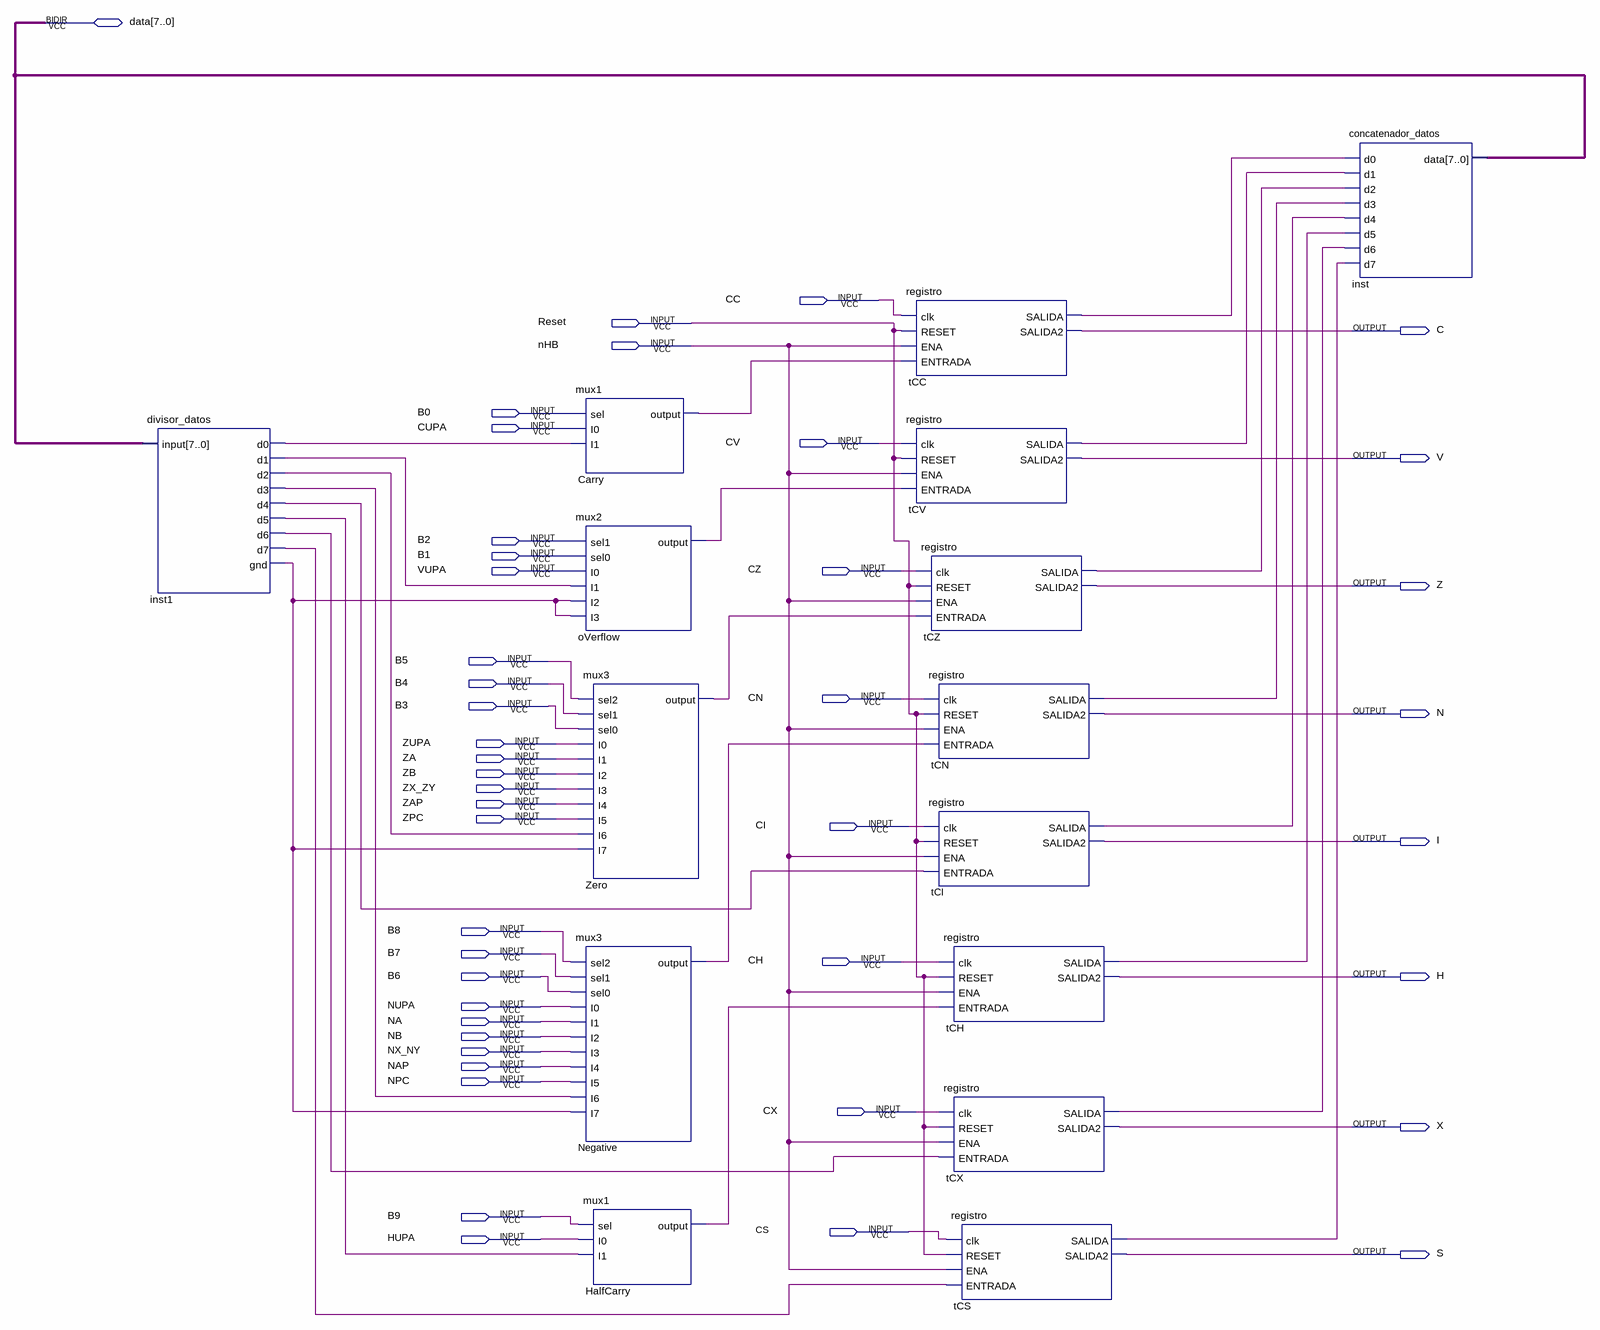
[diagram p0: schematic sheet]
// Quartus schematic RegEdos.bdf as structural Verilog: 15 symbols, 44 pins
module RegEdos (
  input  CC,
  input  Reset,
  input  nHB,
  input  B0,
  input  CUPA,
  input  CV,
  input  B2,
  input  B1,
  input  VUPA,
  input  CZ,
  input  B5,
  input  B4,
  input  CN,
  input  B3,
  input  ZUPA,
  input  ZA,
  input  ZB,
  input  ZX_ZY,
  input  ZAP,
  input  ZPC,
  input  CI,
  input  B8,
  input  B7,
  input  CH,
  input  B6,
  input  NUPA,
  input  NA,
  input  NB,
  input  NX_NY,
  input  NAP,
  input  NPC,
  input  CX,
  input  B9,
  input  CS,
  input  HUPA,
  inout  [7:0] data,
  output C,
  output V,
  output Z,
  output N,
  output I,
  output H,
  output X,
  output S
);

  wire Carry_output, HalfCarry_output, inst1_d0, inst1_d1, inst1_d2, inst1_d3, inst1_d4, inst1_d5, inst1_d6,
       inst1_d7, inst1_gnd, Negative_output, oVerflow_output, tCC_salida, tCH_salida, tCI_salida, tCN_salida,
       tCS_salida, tCV_salida, tCX_salida, tCZ_salida, Zero_output;

  divisor_datos inst1 (
    .\input (data), .d0(inst1_d0), .d1(inst1_d1), .d2(inst1_d2), .d3(inst1_d3), .d4(inst1_d4), .d5(inst1_d5),
    .d6(inst1_d6), .d7(inst1_d7), .gnd(inst1_gnd));
  mux1 Carry (.sel(B0), .I0(CUPA), .I1(inst1_d0), .\output (Carry_output));
  mux2 oVerflow (
    .sel1(B2), .sel0(B1), .I0(VUPA), .I1(inst1_d1), .I2(inst1_gnd), .I3(inst1_gnd), .\output (oVerflow_output));
  mux3 Zero (
    .sel2(B5), .sel1(B4), .sel0(B3), .I0(ZUPA), .I1(ZA), .I2(ZB), .I3(ZX_ZY), .I4(ZAP), .I5(ZPC),
    .I6(inst1_d2), .I7(inst1_gnd), .\output (Zero_output));
  mux3 Negative (
    .sel2(B8), .sel1(B7), .sel0(B6), .I0(NUPA), .I1(NA), .I2(NB), .I3(NX_NY), .I4(NAP), .I5(NPC),
    .I6(inst1_d3), .I7(inst1_gnd), .\output (Negative_output));
  mux1 HalfCarry (.sel(B9), .I0(HUPA), .I1(inst1_d5), .\output (HalfCarry_output));
  registro tCC (.clk(CC), .RESET(Reset), .ENA(nHB), .ENTRADA(Carry_output), .SALIDA(tCC_salida), .SALIDA2(C));
  registro tCV (.clk(CV), .RESET(Reset), .ENA(nHB), .ENTRADA(oVerflow_output), .SALIDA(tCV_salida), .SALIDA2(V));
  registro tCZ (.clk(CZ), .RESET(Reset), .ENA(nHB), .ENTRADA(Zero_output), .SALIDA(tCZ_salida), .SALIDA2(Z));
  registro tCN (.clk(CN), .RESET(Reset), .ENA(nHB), .ENTRADA(Negative_output), .SALIDA(tCN_salida), .SALIDA2(N));
  registro tCI (.clk(CI), .RESET(Reset), .ENA(nHB), .ENTRADA(inst1_d4), .SALIDA(tCI_salida), .SALIDA2(I));
  registro tCH (.clk(CH), .RESET(Reset), .ENA(nHB), .ENTRADA(HalfCarry_output), .SALIDA(tCH_salida), .SALIDA2(H));
  registro tCX (.clk(CX), .RESET(Reset), .ENA(nHB), .ENTRADA(inst1_d6), .SALIDA(tCX_salida), .SALIDA2(X));
  registro tCS (.clk(CS), .RESET(Reset), .ENA(nHB), .ENTRADA(inst1_d7), .SALIDA(tCS_salida), .SALIDA2(S));
  concatenador_datos inst (
    .d0(tCC_salida), .d1(tCV_salida), .d2(tCZ_salida), .d3(tCN_salida), .d4(tCI_salida), .d5(tCH_salida),
    .d6(tCX_salida), .d7(tCS_salida), .data(data));
endmodule
